# Altium schematic sheet FMC_HPC_UFL_DEBUG_TOP.SchDoc: Top level, 3D board views, mounting holes, fiducial marks, and logos
size A4; Date: 13.12.2024; ApprovedBy: PFH; CompanyName: IAM Electronic GmbH; DrawnBy: PFH; Engineer: PFH; DocumentNumber: 1; Revision: A; SheetNumber: 1; SheetTotal: 9; Projekt: FMC HPC-U.FL Debug Board; Website: www.fmchub.com
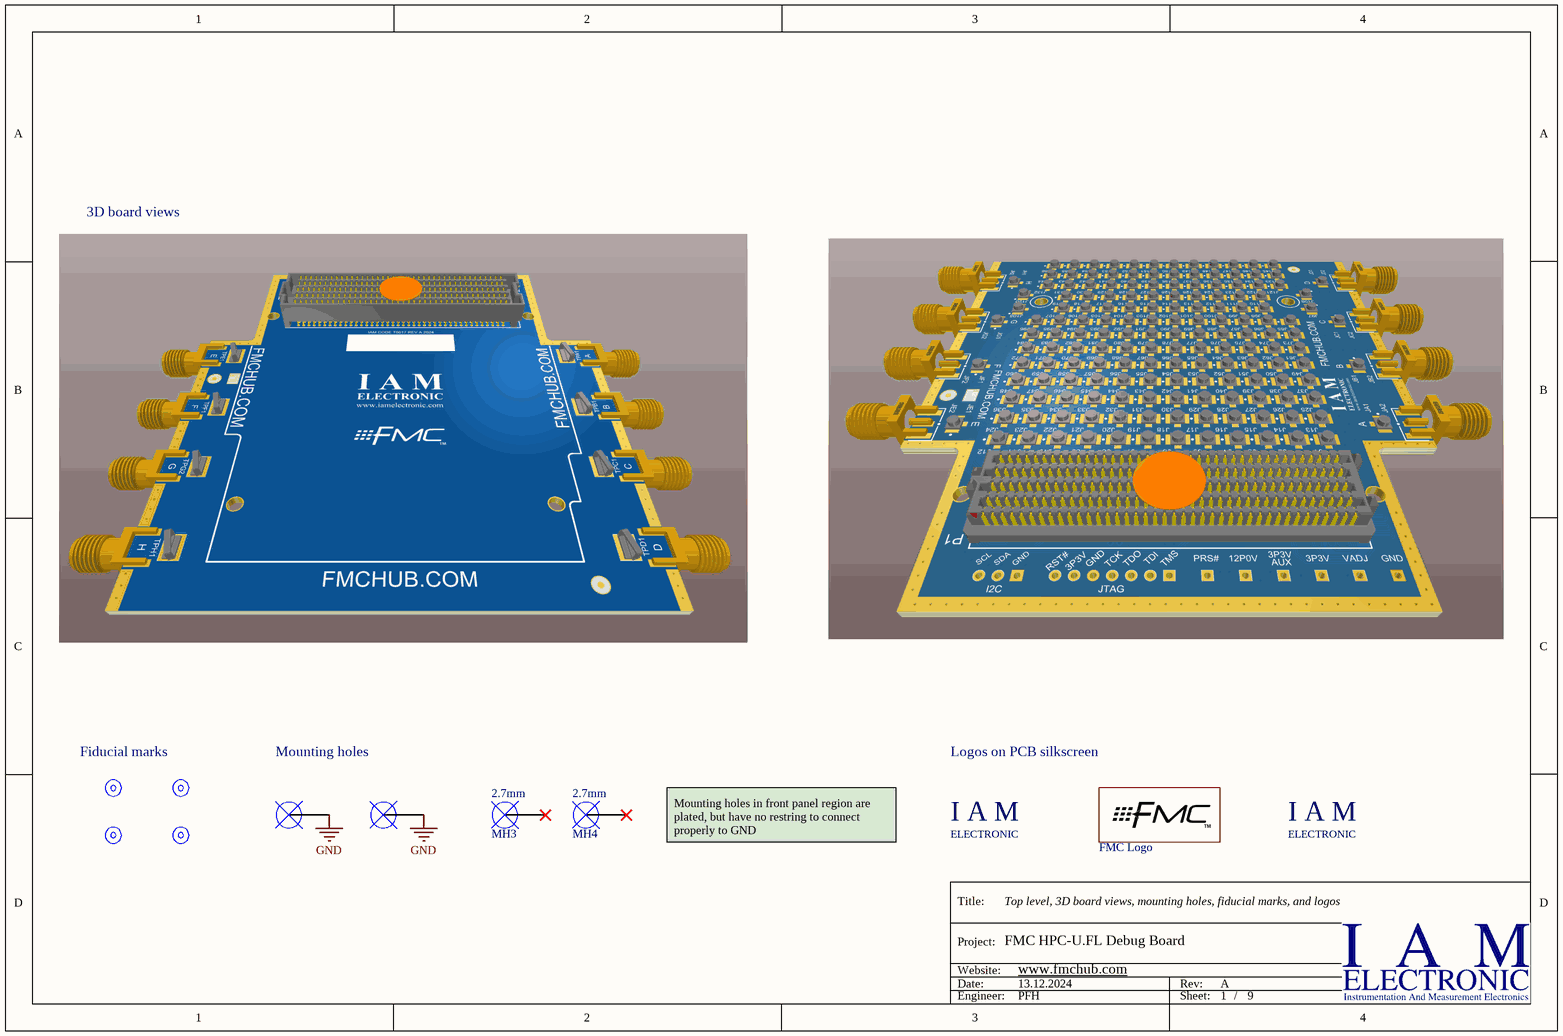
[diagram p0: FMC_HPC_UFL_DEBUG_TOP.SchDoc]

## Parts
FM1  1mm  [FIDUCIAL_MARK_ROUND_RING]  (value not drawn)  (no BOM)
FM2  1mm  [FIDUCIAL_MARK_ROUND_RING]  (value not drawn)  (no BOM)
FM3  1mm  [FIDUCIAL_MARK_ROUND_RING]  (value not drawn)  (no BOM)
FM4  1mm  [FIDUCIAL_MARK_ROUND_RING]  (value not drawn)  (no BOM)
MH1  2.7mm  [Mounting_Hole_Plated_2.7mm-COVERED]  (value not drawn)  (no BOM)
MH2  2.7mm  [Mounting_Hole_Plated_2.7mm-COVERED]  (value not drawn)  (no BOM)
MH3  2.7mm  [Mounting_Hole_Plated_2.7mm - d3.1mm]  (no BOM)
MH4  2.7mm  [Mounting_Hole_Plated_2.7mm - d3.1mm]  (no BOM)
STR1  IAM LOGO  [IAM LOGO - LARGE - WWW]  (value not drawn)  (no BOM)
STR2  FMC Logo  [FMC_TM_LOGO_MEDIUM]  (no BOM)
STR3  IAM LOGO  [IAM LOGO - SMALL - WWW]  (value not drawn)  (no BOM)

## Nets
GND: MH1.0 MH2.0

Not connected (* = marked no-connect by the designer): FM1 FD0; FM2 FD0; FM3 FD0; FM4 FD0; MH3 0*; MH4 0*

## Notes on the sheet
- 3D board views
- Fiducial marks
- Mounting holes
- Logos on PCB silkscreen
- Mounting holes in front panel region are plated, but have no restring to connect properly to GND
- Title:
- Project:
- Date:
- Website:
- Rev:
- Engineer:
- Sheet:
- /
- (in symbol IAM_LOGO) I A M; ELECTRONIC

## Library data of the parts
FM1-FM4 = Fiducial_Mark: Fiducial mark, width 1mm, clearance 3mm; Width: 1 mm; Clearance: 3 mm
MH1-MH4 = Mounting_Hole_2.7mm: Mounting hole, hole size 2.7mm; Hole radius: 2.7 mm; Diameter (plated): *; Keep out (radius): *; Plated: *
STR1 STR3 = IAM_LOGO: I A M E L E C T R O N I C - Logo; Layer: Top Overlay; Manufacturer: IAM ELECTRONIC; Part: Logo
STR2 = FMC_Logo: VITA FMC Logo